# EAGLE schematic scheda mot (EAGLE 9.6.2)
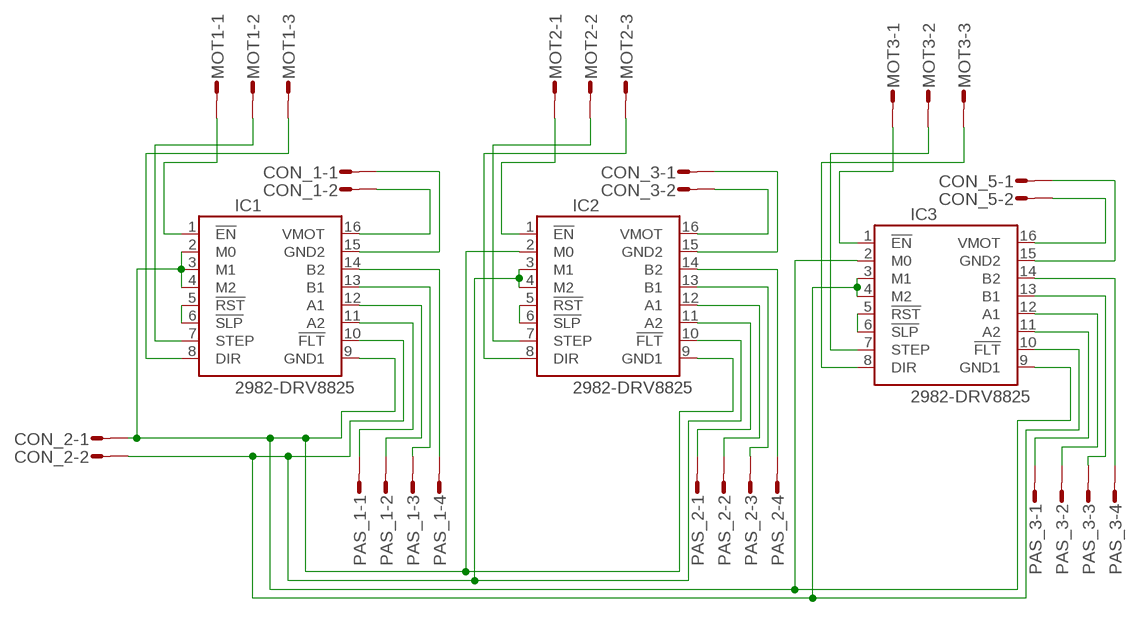
[diagram p0: schematic, sheet 1]

## Parts
CON_1  S02P  [S02P]
CON_2  S02P  [S02P]
CON_3  S02P  [S02P]
CON_5  S02P  [S02P]
IC1  2982-DRV8825  [DRV8825]
IC2  2982-DRV8825  [DRV8825]
IC3  2982-DRV8825  [DRV8825]
MOT1  S03P  [S03P]
MOT2  S03P  [S03P]
MOT3  S03P  [S03P]
PAS_1  S05P  [S05P]
PAS_2  S05P  [S05P]
PAS_3  S05P  [S05P]

## Nets
N$1: IC1.5(!RST) IC1.6(!SLP)
N$2: IC1.14(B2) PAS_1.4
N$3: IC1.13(B1) PAS_1.3
N$4: IC1.12(A1) PAS_1.2
N$5: CON_1.1 IC1.15(GND2)
N$6: CON_1.2 IC1.16(VMOT)
N$7: IC1.11(A2) PAS_1.1
N$9: IC1.1(!EN) MOT1.1
N$11: IC1.8(DIR) MOT1.3
N$12: IC1.7(STEP) MOT1.2
N$13: CON_3.2 IC2.16(VMOT)
N$14: IC2.5(!RST) IC2.6(!SLP)
N$15: IC2.14(B2) PAS_2.4
N$16: IC2.13(B1) PAS_2.3
N$17: IC2.12(A1) PAS_2.2
N$18: IC2.11(A2) PAS_2.1
N$19: CON_3.1 IC2.15(GND2)
N$22: IC2.8(DIR) MOT2.3
N$23: IC2.7(STEP) MOT2.2
N$24: IC2.1(!EN) MOT2.1
N$25: CON_5.2 IC3.16(VMOT)
N$26: IC3.5(!RST) IC3.6(!SLP)
N$27: IC3.14(B2) PAS_3.4
N$28: IC3.13(B1) PAS_3.3
N$29: IC3.12(A1) PAS_3.2
N$30: IC3.11(A2) PAS_3.1
N$31: CON_5.1 IC3.15(GND2)
N$32: CON_2.2 IC1.10(!FLT) IC2.3(M1) IC2.4(M2) IC2.10(!FLT) IC3.3(M1) IC3.4(M2) IC3.10(!FLT)
N$33: CON_2.1 IC1.2(M0) IC1.3(M1) IC1.4(M2) IC1.9(GND1) IC2.2(M0) IC2.9(GND1) IC3.2(M0) IC3.9(GND1)
N$34: IC3.8(DIR) MOT3.3
N$35: IC3.7(STEP) MOT3.2
N$36: IC3.1(!EN) MOT3.1
Unconnected: PAS_1.5 PAS_2.5 PAS_3.5

## Library data of the parts
CON_1-CON_3 CON_5 = con-amp-mt:S02P: AMP MT CONNECTOR; OC_FARNELL: unknown; OC_NEWARK: unknown
IC1-IC3 = pololu-stepper-driver:2982-DRV8825: DRV8825 Stepper Motor Driver Carrier; High Current (Header Pins Soldered) #2982 DRV8825 Stepper Motor Driver Carrier; High Current (Header Pins Soldered) <https://www.pololu.com/product/2982> in Japan, Suzaku Lab. Ltd. <https://suzakugiken.jp/> #2982 DRV8825 大電流用ステッピングモータドライバ (ピンヘッダ実装済み) <https://szc.jp/po2982>
MOT1-MOT3 = con-amp-mt:S03P: AMP MT CONNECTOR; OC_FARNELL: unknown; OC_NEWARK: unknown
PAS_1-PAS_3 = con-amp-mt:S05P: AMP MT CONNECTOR; OC_FARNELL: unknown; OC_NEWARK: unknown